# Altium schematic sheet SWD_Breakout.SchDoc
size Letter; Organization: Altium Limited; Address1: L3, 12a Rodborough Rd; Address2: Frenchs Forest; Address3: NSW; Address4: Australia 2086
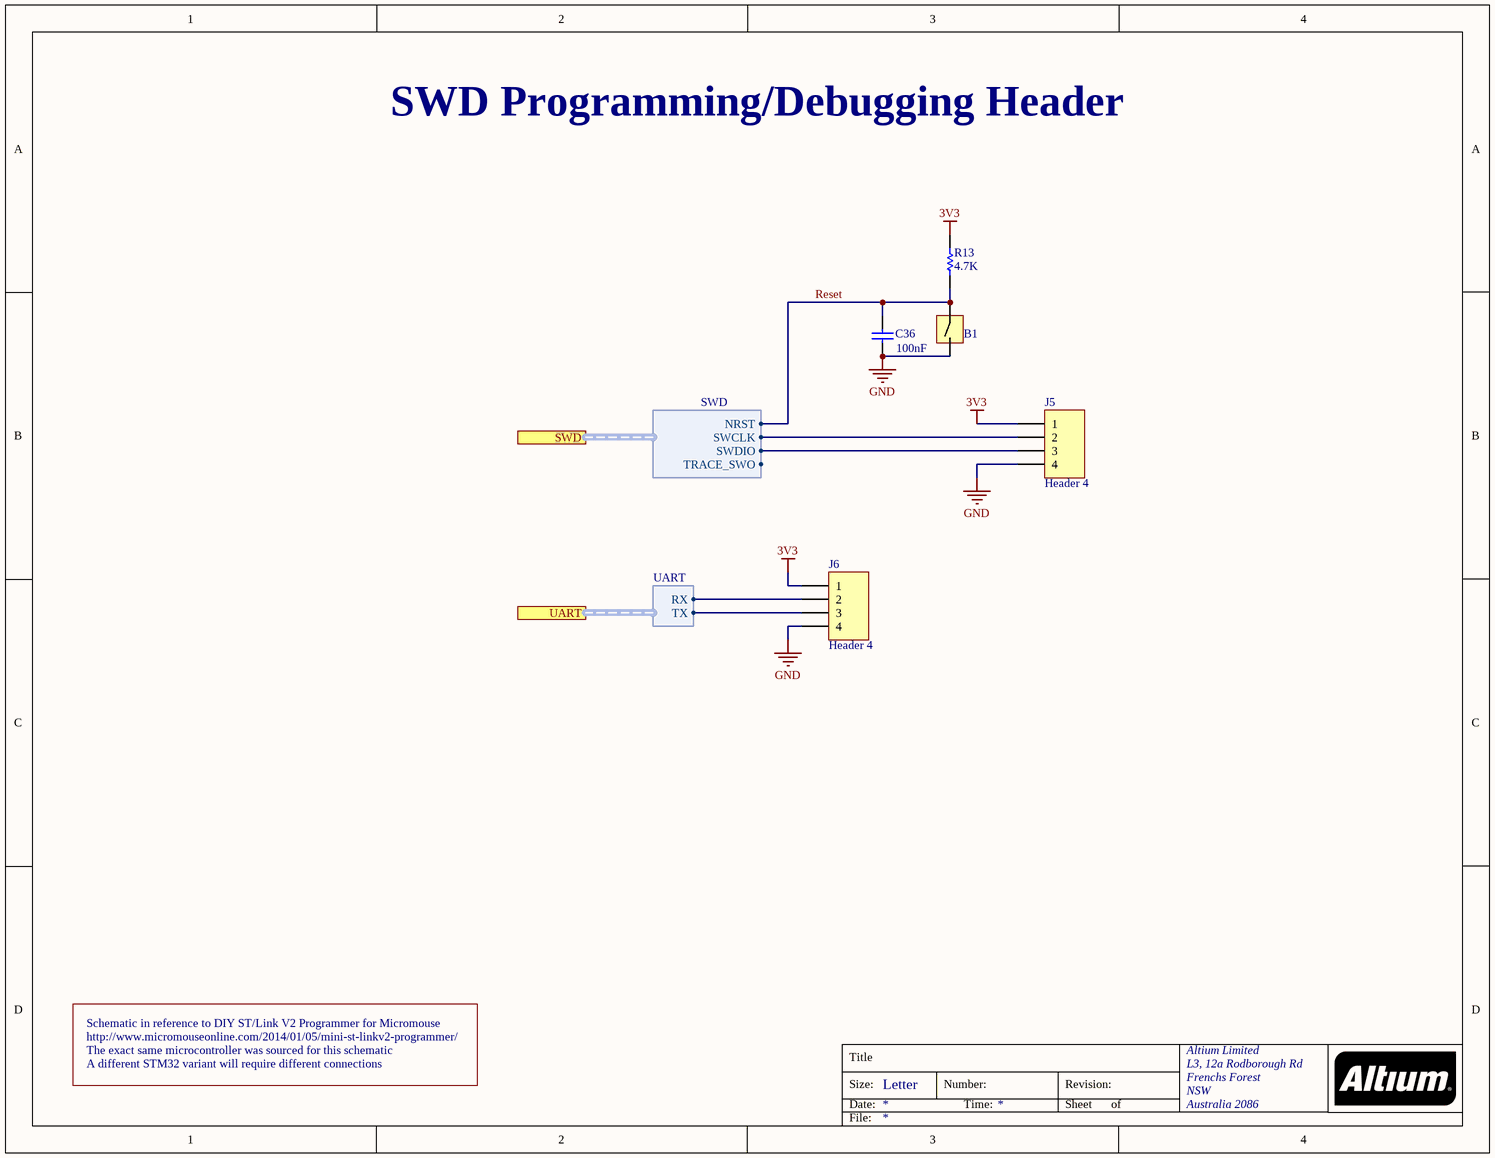
[diagram p0: SWD_Breakout.SchDoc]

## Parts
B1  Push Button  [PUSHBUTTON]  (value not drawn)
C36  value 100nF  [0603]  (hidden comment: Cap)
J5  Header 4  [HDR1X4]
J6  Header 4  [HDR1X4]
R13  value 4.7K  [0603]  (hidden comment: Res1)

## Ports
SWD (harness SWD), UART (harness UART)

## Harnesses
SWD: NRST, SWCLK, SWDIO, TRACE_SWO
UART: RX, TX

## Nets
3V3: J5.1 J6.1 R13.2
GND: B1.2 C36.1 J5.4 J6.4
Reset: B1.1 C36.2 R13.1 ; port SWD.NRST
NetJ5_2: J5.2 ; port SWD.SWCLK
NetJ5_3: J5.3 ; port SWD.SWDIO
NetJ6_2: J6.2 ; port UART.RX
NetJ6_3: J6.3 ; port UART.TX

## Notes on the sheet
- SWD Programming/Debugging Header
- http://www.micromouseonline.com/2014/01/05/mini-st-linkv2-programmer/
- Schematic in reference to DIY ST/Link V2 Programmer for Micromouse
- The exact same microcontroller was sourced for this schematic
- A different STM32 variant will require different connections
- Title
- Size:
- Date:
- Letter
- Number:
- Time:
- Revision:
- Sheet
- of
- File:

## Library data of the parts
B1 = PushButton
C36 = Cap: Capacitor
J5 J6 = Header 4: Header, 4-Pin; LatestRevisionDate: 17-Jul-2002; LatestRevisionNote: Re-released for DXP Platform.; Publisher: Altium Limited
R13 = Res1: Resistor